# EasyEDA schematic easyeda-schematic.json
TITLE: 6key2 rev.2; REV: 1.0; Date: 2021-07-10; Sheet: 1/1; Drawn By: softplus; Company: Your Company
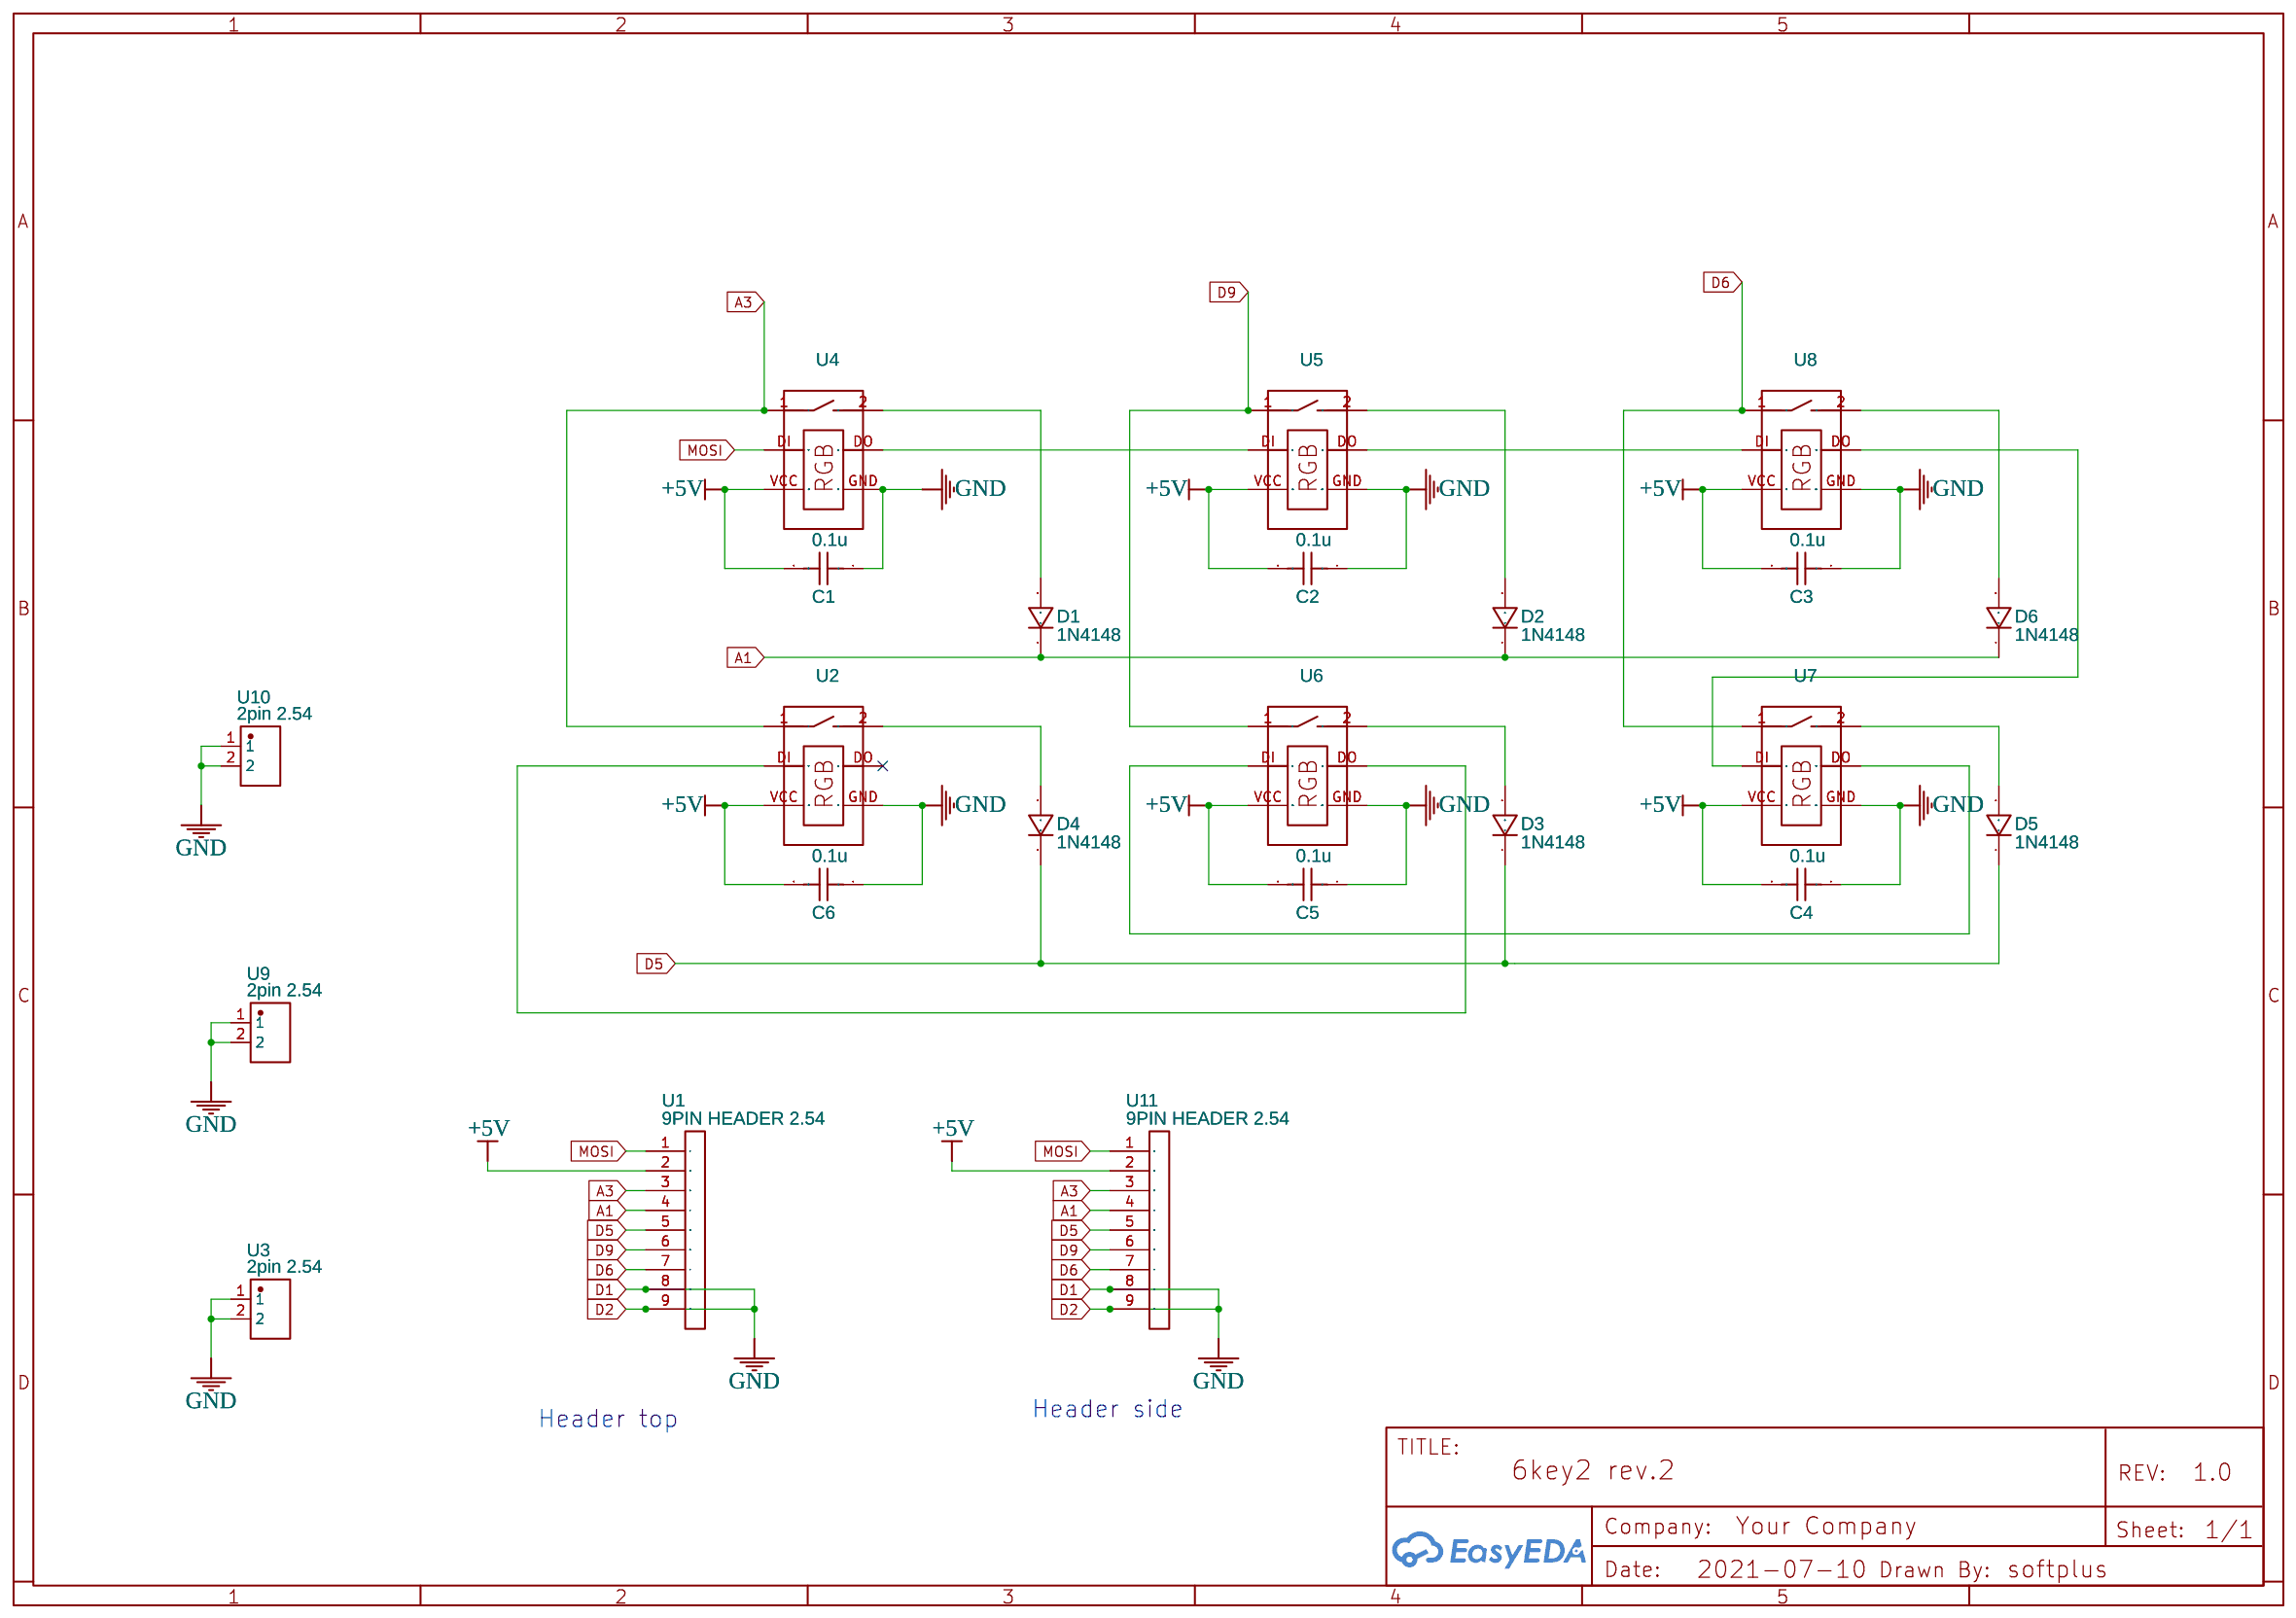
[diagram p0: schematic sheet]

## Parts
C1  0.1u  [C0603]
C2  0.1u  [C0603]
C3  0.1u  [C0603]
C4  0.1u  [C0603]
C5  0.1u  [C0603]
C6  0.1u  [C0603]
D1  1N4148  [SOD-123_L2.8-W1.8-LS3.7-RD]
D2  1N4148  [SOD-123_L2.8-W1.8-LS3.7-RD]
D3  1N4148  [SOD-123_L2.8-W1.8-LS3.7-RD]
D4  1N4148  [SOD-123_L2.8-W1.8-LS3.7-RD]
D5  1N4148  [SOD-123_L2.8-W1.8-LS3.7-RD]
D6  1N4148  [SOD-123_L2.8-W1.8-LS3.7-RD]
U1  9PIN HEADER 2.54  [9PIN HEADER 2.54]
U2  KEY_UNIVERSAL_MX_PG1350 1425 RGB  [KEY_UNIVERSAL_MX_PG1350 1425 RGB]
U3  2pin 2.54  [2PIN HEADER 2.54]
U4  KEY_UNIVERSAL_MX_PG1350 1425 RGB  [KEY_UNIVERSAL_MX_PG1350 1425 RGB]
U5  KEY_UNIVERSAL_MX_PG1350 1425 RGB  [KEY_UNIVERSAL_MX_PG1350 1425 RGB]
U6  KEY_UNIVERSAL_MX_PG1350 1425 RGB  [KEY_UNIVERSAL_MX_PG1350 1425 RGB]
U7  KEY_UNIVERSAL_MX_PG1350 1425 RGB  [KEY_UNIVERSAL_MX_PG1350 1425 RGB]
U8  KEY_UNIVERSAL_MX_PG1350 1425 RGB  [KEY_UNIVERSAL_MX_PG1350 1425 RGB]
U9  2pin 2.54  [2PIN HEADER 2.54]
U10  2pin 2.54  [2PIN HEADER 2.54]
U11  9PIN HEADER 2.54  [9PIN HEADER 2.54]

## Library data of the parts
C1-C6 = C_0603_US: Contributor: LCEDA_Lib
D1-D6 = 1N4007W: Supplier: LCSC; Supplier Part: C328592; Manufacturer: BLUE ROCKET; Contributor: LCEDA_Lib
U1 U11 = 9PIN HEADER 2.54: Contributor: johnmu
U2 U4-U8 = KEY_UNIVERSAL_MX_PG1350 1425 RGB: Contributor: softplus
U3 U9 U10 = 2pin 2.54: Manufacturer Part: 2pin; Contributor: Aero7m1th _; LCSC Assembly: Yes; SMT Type: Extend; Assembly Type: manualWeld; Paste Type: expand

## Nets
+5V: C1.2 C2.2 C3.2 C4.2 C5.2 C6.2 U1.2 U2.VCC U4.VCC U5.VCC U6.VCC U7.VCC U8.VCC U11.2
A1: D1.1 D2.1 D6.1 U1.4 U11.4
A3: U1.3 U2.1 U4.1 U11.3
D1: C1.1 C2.1 C3.1 C4.1 C5.1 C6.1 U1.8 U1.9 U2.GND U3.1 U3.2 U4.GND U5.GND U6.GND U7.GND U8.GND U9.1 U9.2 U10.1 U10.2 U11.8 U11.9
D5: D3.1 D4.1 D5.1 U1.5 U11.5
D6: U1.7 U7.1 U8.1 U11.7
D9: U1.6 U5.1 U6.1 U11.6
MOSI: U1.1 U4.DI U11.1
Net-(D1-2): D1.2 U4.2
Net-(D2-2): D2.2 U5.2
Net-(D3-2): D3.2 U6.2
Net-(D4-2): D4.2 U2.2
Net-(D5-2): D5.2 U7.2
Net-(D6-2): D6.2 U8.2
Net-(U2-DI): U2.DI U6.DO
Net-(U4-DO): U4.DO U5.DI
Net-(U5-DO): U5.DO U8.DI
Net-(U6-DI): U6.DI U7.DO
Net-(U7-DI): U7.DI U8.DO

Not connected (* = marked no-connect by the designer): U2 DO*

## Notes on the sheet
- Header side
- Header top
